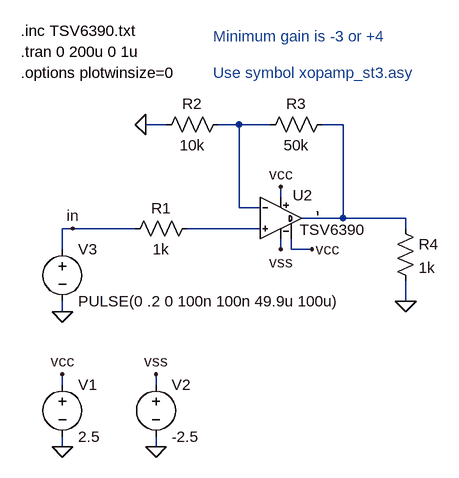
[diagram p0: schematic TSV6390_test.asc]
TSV6390_test.asc, the LTspice schematic file:
Version 4
SHEET 1 880 680
WIRE 176 16 144 16
WIRE 288 16 256 16
WIRE 336 16 288 16
WIRE 448 16 416 16
WIRE 352 128 352 112
WIRE 288 144 288 16
WIRE 320 144 288 144
WIRE 448 160 448 16
WIRE 448 160 384 160
WIRE 544 160 448 160
WIRE 32 176 16 176
WIRE 128 176 32 176
WIRE 320 176 208 176
WIRE 544 176 544 160
WIRE 16 208 16 176
WIRE 352 208 352 192
WIRE 368 208 368 192
WIRE 400 208 368 208
WIRE 544 288 544 256
WIRE 16 304 16 288
WIRE 16 416 16 400
WIRE 160 416 160 400
WIRE 16 512 16 496
WIRE 160 512 160 496
FLAG 16 512 0
FLAG 160 512 0
FLAG 16 400 vcc
FLAG 160 400 vss
FLAG 352 112 vcc
FLAG 352 208 vss
FLAG 16 304 0
FLAG 32 176 in
FLAG 144 16 0
FLAG 544 288 0
FLAG 400 208 vcc
SYMBOL voltage 16 400 R0
SYMATTR InstName V1
SYMATTR Value 2.5
SYMBOL voltage 160 400 R0
SYMATTR InstName V2
SYMATTR Value -2.5
SYMBOL voltage 16 192 R0
WINDOW 123 0 0 Left 0
WINDOW 39 0 0 Left 0
SYMATTR InstName V3
SYMATTR Value PULSE(0 .2 0 100n 100n 49.9u 100u)
SYMBOL res 112 192 R270
WINDOW 0 32 56 VTop 0
WINDOW 3 0 56 VBottom 0
SYMATTR InstName R1
SYMATTR Value 1k
SYMBOL res 160 32 R270
WINDOW 0 32 56 VTop 0
WINDOW 3 0 56 VBottom 0
SYMATTR InstName R2
SYMATTR Value 10k
SYMBOL res 320 32 R270
WINDOW 0 32 56 VTop 0
WINDOW 3 0 56 VBottom 0
SYMATTR InstName R3
SYMATTR Value 50k
SYMBOL res 528 160 R0
SYMATTR InstName R4
SYMATTR Value 1k
SYMBOL xopamp_st3 352 96 R0
SYMATTR InstName U2
SYMATTR Value TSV6390
TEXT -48 -96 Left 0 !.tran 0 200u 0 1u
TEXT -48 -64 Left 0 !.options plotwinsize=0
TEXT 248 -64 Left 0 ;Use symbol xopamp_st3.asy
TEXT -48 -128 Left 0 !.inc TSV6390.txt
TEXT 248 -120 Left 0 ;Minimum gain is -3 or +4

The netlist it stands for:
* TSV6390_test.asc
V1 vcc 0 2.5
V2 vss 0 -2.5
V3 in 0 PULSE(0 .2 0 100n 100n 49.9u 100u)
R1 in N003 1k
R2 0 N001 10k
R3 N001 N002 50k
R4 N002 0 1k
XU2 N001 N003 N002 vcc vss vcc TSV6390  ; pins In- In+ OUT V+ V- DIS
.tran 0 200u 0 1u
.options plotwinsize=0
* Use symbol xopamp_st3.asy
.inc TSV6390.txt
* Minimum gain is -3 or +4
.backanno
.end